# EAGLE design TempSensor (EAGLE 9.6.2)
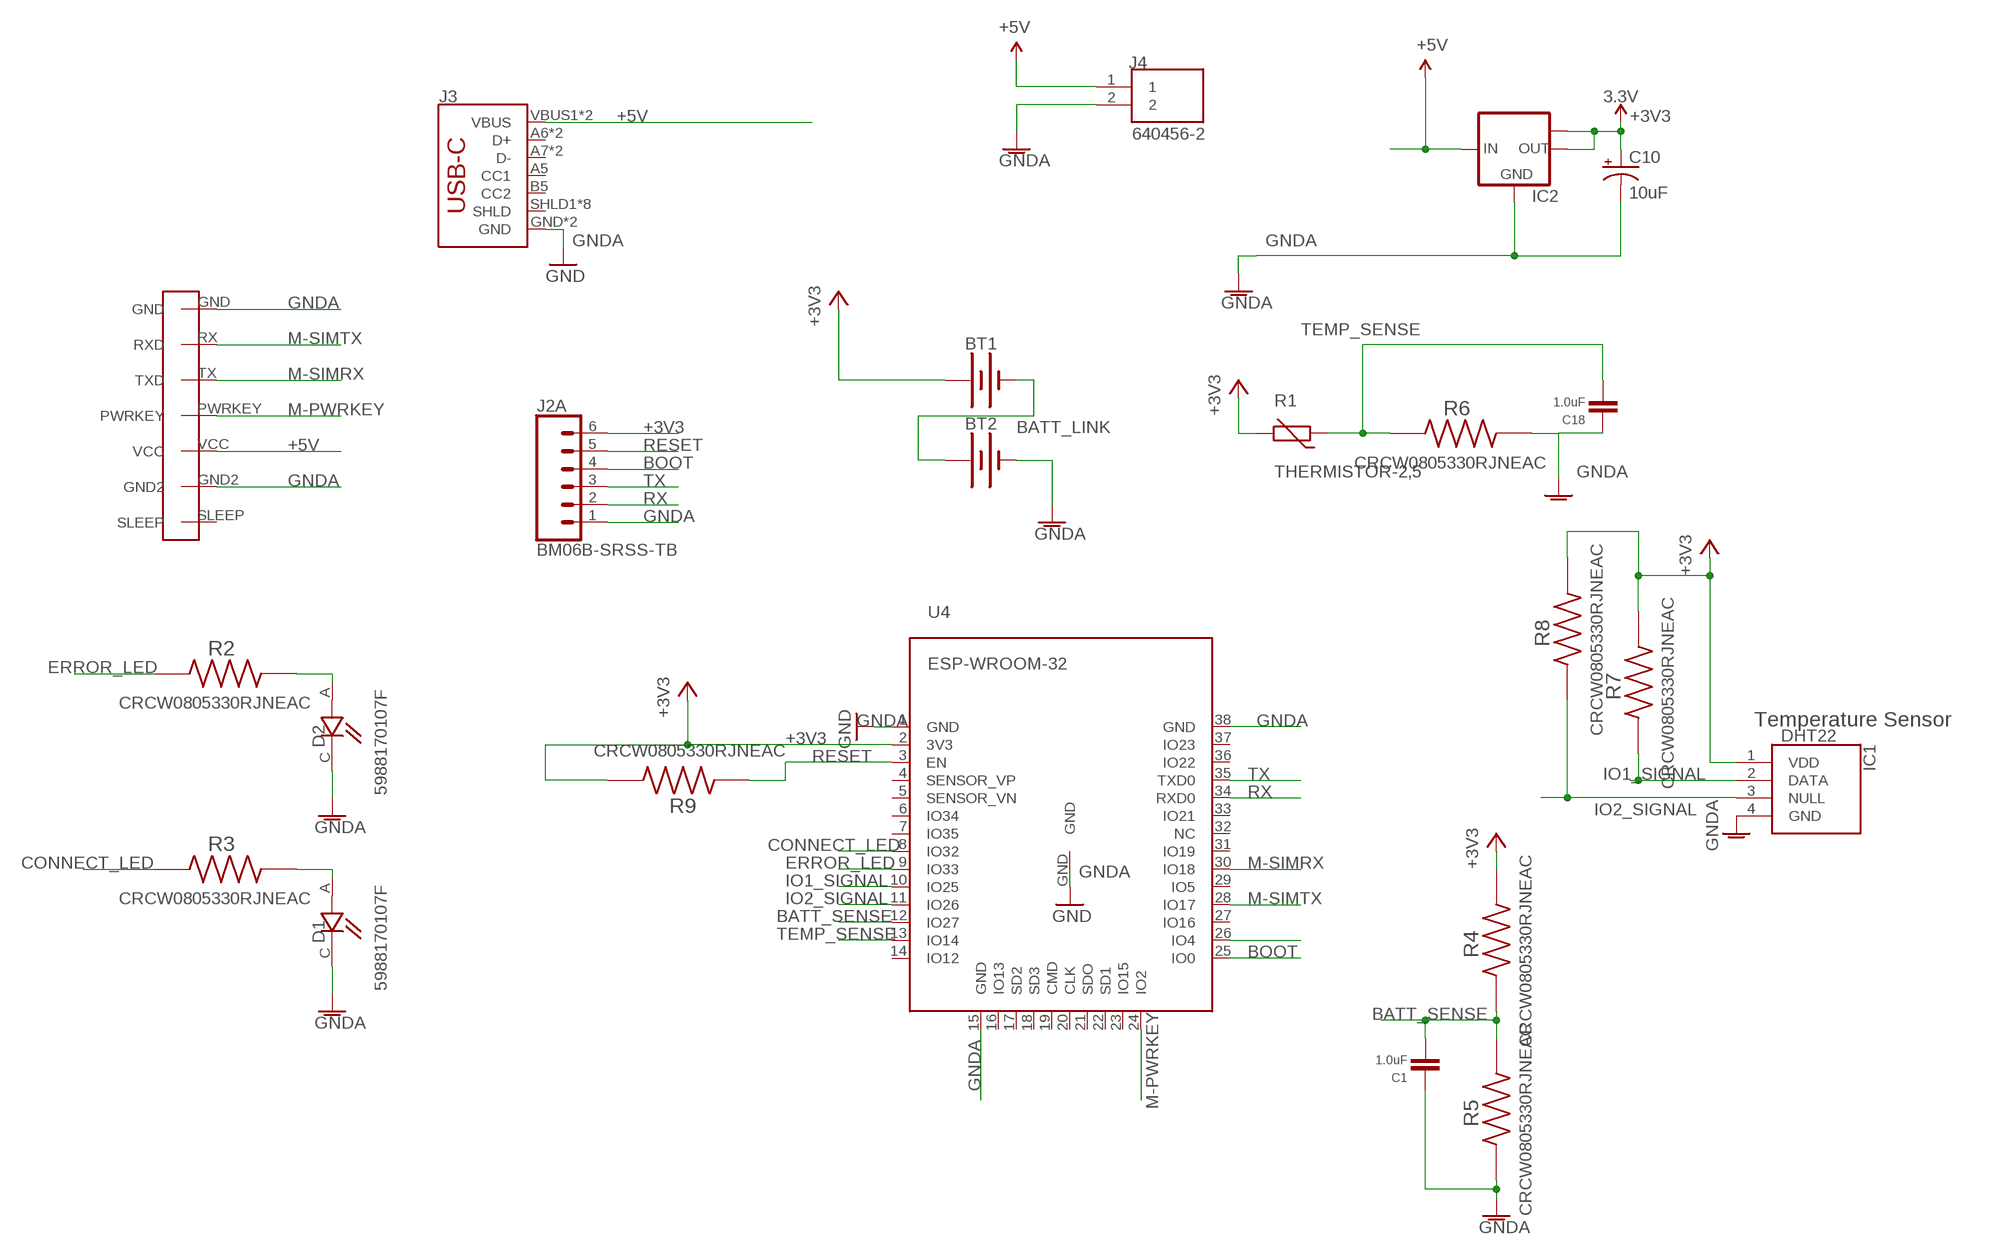
[diagram p0: schematic, sheet 1]

## Parts
BT1  BATTERY-AA  [BATTERY-AA]
BT2  BATTERY-AA  [BATTERY-AA]
C1  1.0uF  1.0UF-0805-25V-(+80/-20%)  [0805]
C10  10uF  10UF-POLAR-EIA3216-16V-10%(TANT)  [EIA3216]
C18  1.0uF  1.0UF-0805-25V-(+80/-20%)  [0805]
D1  5988170107F  [LEDC2012X70N]
D2  5988170107F  [LEDC2012X70N]
IC1  DHT22  [DHT22]
IC2  LM1117MPX-3.3  [SOT223]
J1  SIM7000A  [SIM7000A]
J2  BM06B-SRSS-TB  JST_6_PIN_HORIZONTAL  [JST-6-SMD-HORI-1.0MM]
J3  USB_C16PIN  [USB-C-16P]
J4  640456-2  [TE_640456-2]
R1  THERMISTOR-2,5  [RS-2,5]
R2  CRCW0805330RJNEAC  [RESC2012X60N]
R3  CRCW0805330RJNEAC  [RESC2012X60N]
R4  CRCW0805330RJNEAC  [RESC2012X60N]
R5  CRCW0805330RJNEAC  [RESC2012X60N]
R6  CRCW0805330RJNEAC  [RESC2012X60N]
R7  CRCW0805330RJNEAC  [RESC2012X60N]
R8  CRCW0805330RJNEAC  [RESC2012X60N]
R9  CRCW0805330RJNEAC  [RESC2012X60N]
U4  ESP-WROOM-32  [ESP-WROOM-32]

## Nets
+3V3 [5V Power]: BT1.PWR@1(+) C10.+ IC1.1(VDD) IC2.2(OUT) IC2.TAB(OUT1) J2.6 R1.2 R4.2 R7.2 R8.2 R9.2 U4.2(3V3) ; supply symbol labelled 3.3V
+5V [5V Power]: IC2.3(IN) J1.VCC J3.VBUS1(VBUS) J3.VBUS2(VBUS) J4.1 ; supply symbol labelled 5V
BATT_LINK: BT1.GND@1(-) BT2.PWR@1(+)
BATT_SENSE: C1.2 R4.1 R5.2 U4.12(IO27)
BOOT: J2.4 U4.25(IO0)
CONNECT_LED: R3.1 U4.8(IO32)
ERROR_LED: R2.1 U4.9(IO33)
GNDA: BT2.GND@1(-) C1.1 C10.- C18.1 D1.C D2.C IC1.4(GND) IC2.1(GND) J1.GND J1.GND2 J2.1 J3.GND J3.GND2(GND) J4.2 R5.1 R6.2 U4.1(GND) U4.15(GND) U4.38(GND) U4.GND ; supply symbol labelled GND
IO1_SIGNAL: IC1.2(DATA) R7.1 U4.10(IO25)
IO2_SIGNAL: IC1.3(NULL) R8.1 U4.11(IO26)
M-PWRKEY: J1.PWRKEY U4.24(IO2)
M-SIMRX: J1.TX(TXD) U4.30(IO18)
M-SIMTX: J1.RX(RXD) U4.28(IO17)
N$1: U4.26(IO4)
N$5: D1.A R3.2
N$6: D2.A R2.2
RESET: J2.5 R9.1 U4.3(EN)
RX: J2.2 U4.34(RXD0)
TEMP_SENSE [LOGIC]: C18.2 R1.1 R6.1 U4.13(IO14)
TX: J2.3 U4.35(TXD0)
Unconnected: J1.SLEEP J2.M1 J2.M2 J3.A5(CC1) J3.A6(D+) J3.A7(D-) J3.B5(CC2) J3.B6(D+) J3.B7(D-) J3.SHLD1(SHLD) J3.SHLD2(SHLD) J3.SHLD3(SHLD) J3.SHLD4(SHLD) J3.SHLD5(SHLD) J3.SHLD6(SHLD) J3.SHLD7(SHLD) J3.SHLD8(SHLD) U4.4(SENSOR_VP) U4.5(SENSOR_VN) U4.6(IO34) U4.7(IO35) U4.14(IO12) U4.16(IO13) U4.17(SD2) U4.18(SD3) U4.19(CMD) U4.20(CLK) U4.21(SDO) U4.22(SD1) U4.23(IO15) U4.27(IO16) U4.29(IO5) U4.31(IO19) U4.32(NC) U4.33(IO21) U4.36(IO22) U4.37(IO23)

## Notes on the sheet
- Temperature Sensor

## Library data of the parts
BT1 BT2 = SparkFun-Batteries:BATTERY: Battery - Single Cell A variety of battery chemistries, sizes, and footprints. Device List: 20MM_PTH - Coin Cell Battery Holder - 20mm (PTH) <https://www.sparkfun.com/products/783> 6.8MM_PTH - Coin Cell Battery Holder - 6.8MM(SMD) <https://www.digikey.com/product-detail/en/seiko-instruments/MS621FE-FL11E/728-1057-ND/1889208?WT.srch=1&gclid=CNOQ5a6LzdQCFZS2wAodXCkE0g> 12MM_SMD - Coin Cell Battery Holder - 12mm (SMD) <https://www.sparkfun.com/products/10592> 12MM_PTH - Coin Cell Battery Holder - 12mm (PTH) <https://www.sparkfun.com/products/7948> 20MM_SMD - 20mm Coin Cell Battery Holder (SMD) (2 legs) Used on the Big Time Watch Kit <https://www.sparkfun.com/products/11734> 20MM_SMD_4LEGS - Coin Cell Battery Holder - 20mm (SMD) <https://www.sparkfun.com/products/11892> 20MM_SMD_4LEGS_OVERPASTE - Coin Cell Battery Holder - 20mm (SMD) <https://www.sparkfun.com/products/11892> (Over-paste on the legs) 24.5MM_PTH - Coin Cell Battery Holder - 24.5mm (PTH) <https://www.sparkfun.com/products/8863> 9V - 9V Battery Holder - PC Mount Used on the SparkFun SparkPunk Sound Kit <https://www.sparkfun.com/products/11177> and SparkFun SparkPunk Sequencer Kit <https://www.sparkfun.com/products/12707> 18650 - Battery Holder - 18650 (PTH) <https://www.sparkfun.com/products/13113> AA - Battery Holder - 1xAA (PTH) <https://www.sparkfun.com/products/7949> AAA - Battery Holder - 1xAAA (PTH) <https://www.sparkfun.com/products/12718> AA_KIT - Battery Holder - 1xAA (PTH) <https://www.sparkfun.com/products/7949> Special kit package - pads only have exposed copper on one side of the board. AAA_KIT - Battery Holder - 1xAAA (PTH) <https://www.sparkfun.com/products/12718> Special kit package - pads only have exposed copper on one side of the board.; PROD_ID: BATT-08316; SF_SKU: PRT-07949
C1 C18 = SparkFun-Capacitors:1.0UF: 1µF ceramic capacitors A capacitor is a passive two-terminal electrical component used to store electrical energy temporarily in an electric field.; PROD_ID: CAP-11625
C10 = SparkFun-Capacitors:10UF-POLAR: 10.0µF polarized capacitors A capacitor is a passive two-terminal electrical component used to store electrical energy temporarily in an electric field.; PROD_ID: CAP-00811
D1 D2 = 5988170107F:5988170107F: Standard LEDs - SMD Green Water Clr 40mcd 570nm; DESCRIPTION: Green 566nm LED Indication - Discrete 2V 0805 (2012 Metric); DIGI-KEY_PART_NUMBER: 350-2044-1-ND; MF: Dialight; MP: 5988170107F; PACKAGE: 0805 Dialight; PURCHASE-URL: https://pricing.snapeda.com/search/part/5988170107F/?ref=eda
IC1 = DHT22:DHT22: Digital-output relative humidity & temperature sensor/module DHT22 Source: Datasheet <https://datasheet4u.com/datasheet-parts/DHT22-datasheet.php?id=792211>; DESCRIPTION: Digital-output relative humidity & temperature sensor/module DHT22; HEIGHT: 25.1mm; MANUFACTURER_NAME: Aosong Electronics; MANUFACTURER_PART_NUMBER: DHT22
IC2 = lm1117:LM1117MPX-*
J1 = SoftwareLogisticsParts:SIM7000A
J2 = SparkFun-Connectors:JST_6_PIN_HORIZONTAL: JST 6 pin horizontal connector JST-SH type. Here is the connector we sell at SparkFun: name <link> (XXX-00000) Datasheet <http://www.sparkfun.com/datasheets/GPS/EM406-SMDConnector-eSH.pdf> It was used on these SparkFun products: name <link> (XXX-00000) name <link> (XXX-00000); PROD_ID: XXX-00000
J3 = SparkFun-Connectors:USB_C: USB Type C 16Pin Connector Super Speed pins not available on the 16-pin purely SMD connector so this part is best for USB 2.0 implementations. D1 and D2 are tied together enabling D+/- no matter which way the cable is plugged into the connector. The two channel configuration pins (CC1/2) are exposed. These are normally connected to ground via 5.1k resistors but can be reconfigured for high current/high power applications.; PROD_ID: CONN-14122
J4 = 640456-2:640456-2: 220P MTA100 HDR ASSY SQ SPCL; COMMENT: 640456-2; DESCRIPTION: Connector Header Through Hole 2 position 0.100 (2.54mm); DIGI-KEY_PART_NUMBER: A1921-ND; EU_ROHS_COMPLIANCE: Compliant; MF: TE Connectivity; MP: 640456-2; PACKAGE: None; PURCHASE-URL: https://pricing.snapeda.com/search/part/640456-2/?ref=eda
R1 = varistor:THERMISTOR: THERMISTOR
R2-R9 = CRCW0805330RJNEAC:CRCW0805330RJNEAC; DESCRIPTION: 330 Ohms ±5% 0.125W, 1/8W Chip Resistor 0805 (2012 Metric) - Thick Film; DIGI-KEY_PART_NUMBER: 541-4168-1-ND; MF: Vishay; MP: CRCW0805330RJNEAC; PACKAGE: 2012 Vishay; PURCHASE-URL: https://pricing.snapeda.com/search/part/CRCW0805330RJNEAC/?ref=eda
U4 = esp32:ESP-WROOM-32

## Net classes
1 5V Power: width 0.203 mm
3 LOGIC: width 0.203 mm

## Board
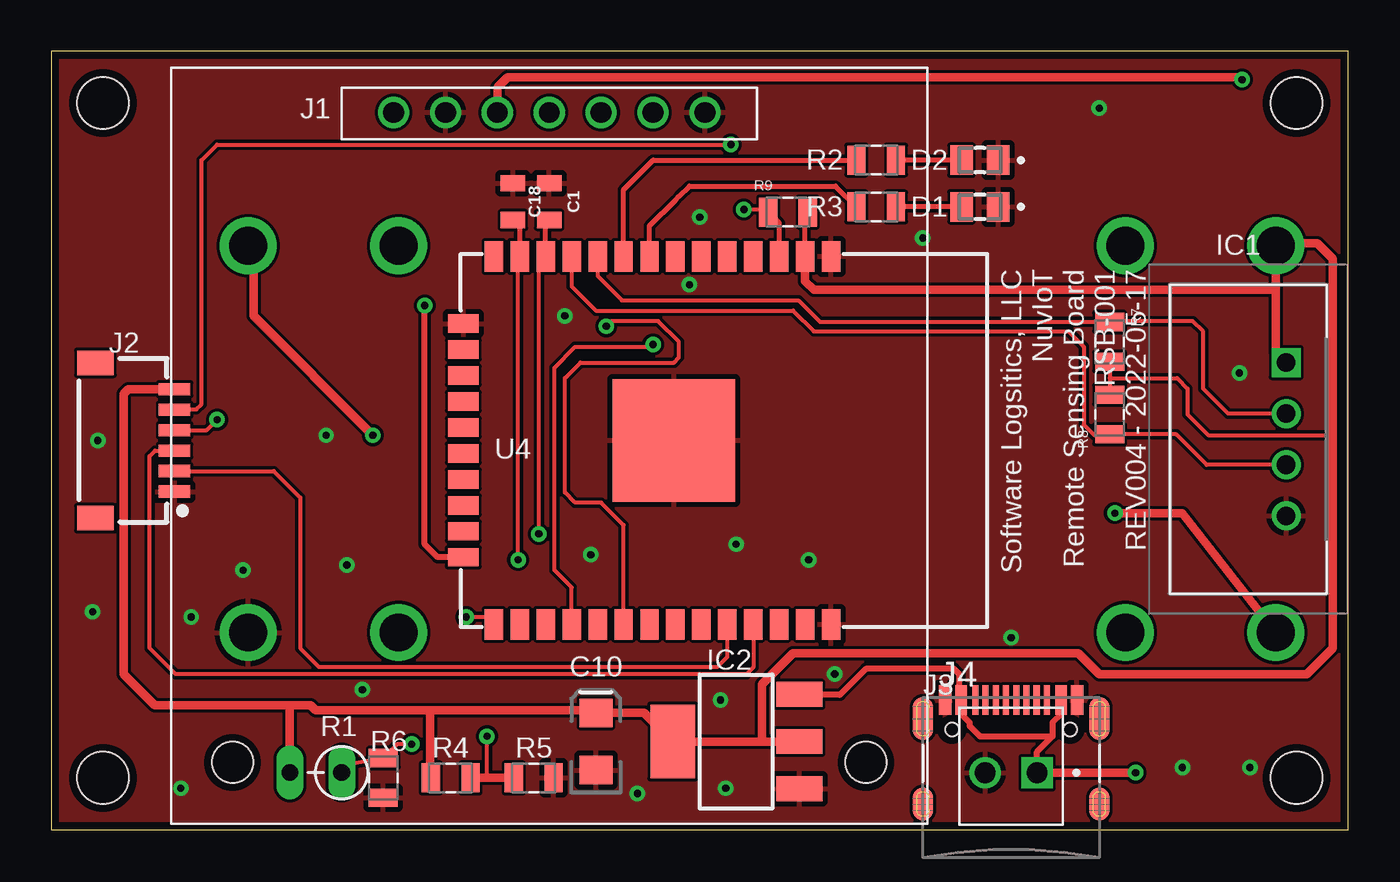
[diagram p1: board, top side]
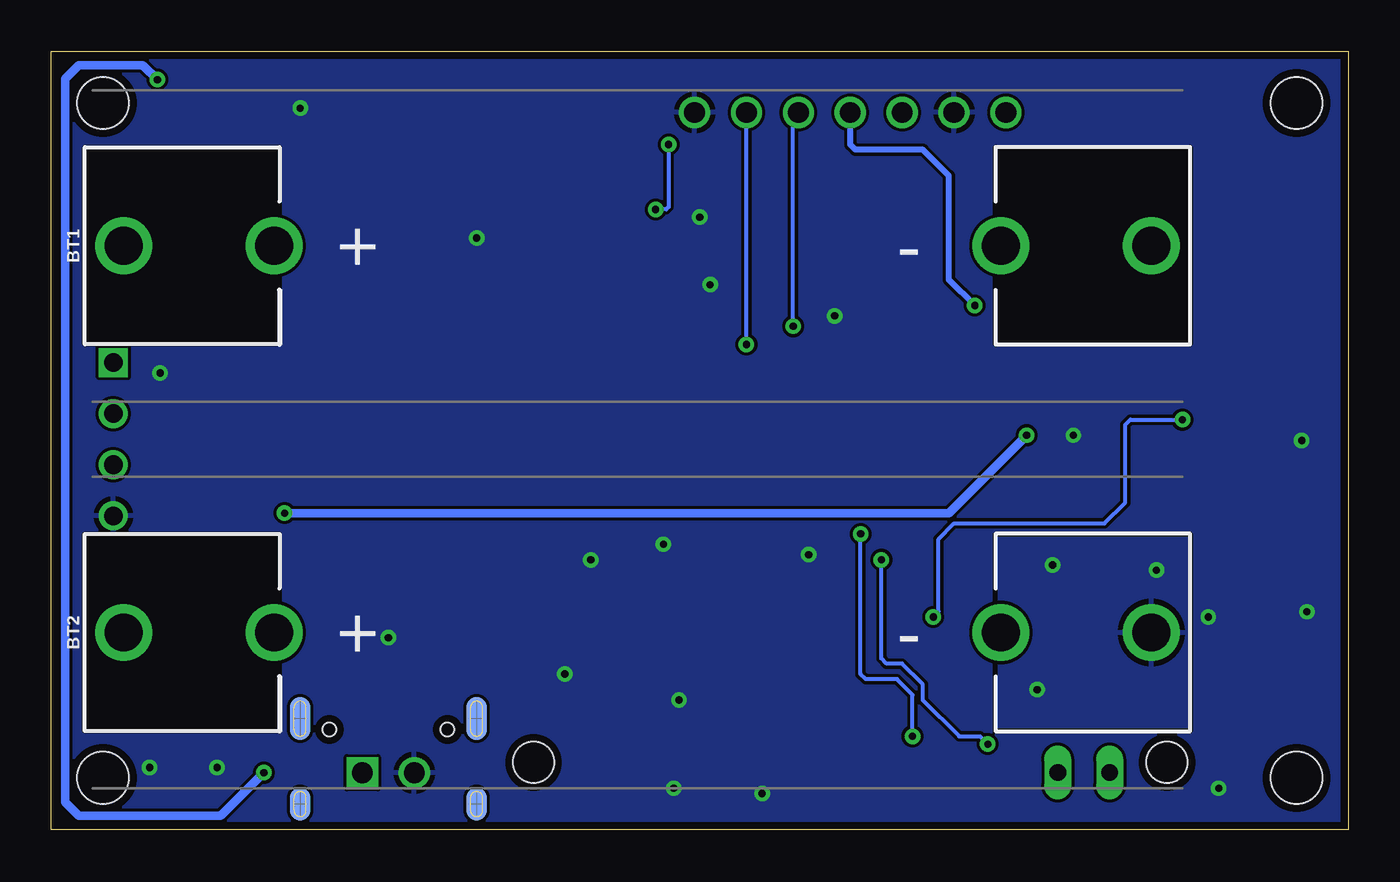
[diagram p2: board, bottom side, seen from below]

Size 63.5 x 38.1 mm. Coordinates in mm from the lower left corner, seen from the top.
Outline: 0,0 63.5,0 63.5,38.1 0,38.1 0,0
Copper layers (1*16): Top 0.035mm / dielectric 1.5mm / Bottom 0.035mm
Design rules "default *": minimum track width 6mil, minimum drill 0.35mm, track to track 6mil, track to pad 6mil, pad to pad 6mil, via to via 6mil, smd to smd 6mil, copper to edge 15mil, drill to drill 6mil, minimum pad ring 10mil, minimum via ring 8mil, stop-mask expansion 4mil, vias tented up to drill 0mil, thermal gap 10mil
Holes 2.54 mm at 2.54,35.56 2.54,2.54 60.96,2.54 60.96,35.56

### Footprints (pad centres in the part's own frame; a part is rotated, then mirrored left to right if it is on the bottom)
BATTERY-AA = drill 1.854: GND@1 25.146,0; GND@2 17.78,0; PWR@1 -25.146,0; PWR@2 -17.78,0
0805 = smd 0.8 x 1.2: 1 -0.9,0; 2 0.9,0
EIA3216 = smd 1.4 x 1.6: + 1.4,0; - -1.4,0
LEDC2012X70N = smd 1.1 x 1.45: A 0.9,0; C -0.9,0
DHT22 = drill 0.91 pad 1.416 square: 1 0,0 | drill 0.91 pad 1.416: 2 2.5,0; 3 5,0; 4 7.5,0
SOT223 = smd 1.219 x 2.235: 1 -2.311,-3.099; 2 0,-3.099; 3 2.311,-3.099 | smd 3.6 x 2.2: TAB 0,3.099
SIM7000A = drill 1.016: GND -16.3,7.62; GND2 -16.3,-5.08; PWRKEY -16.3,0; RX -16.3,5.08; SLEEP -16.3,-7.62; TX -16.3,2.54; VCC -16.3,-2.54 | hole 2: 15.5,-15.5; 15.5,15.5
JST-6-SMD-HORI-1.0MM = smd 0.6 x 1.55: 1 -2.5,-4.775; 2 -1.5,-4.775; 3 -0.5,-4.775; 4 0.5,-4.775; 5 1.5,-4.775; 6 2.5,-4.775 | smd 1.2 x 1.8: M1 -3.8,-0.9; M2 3.8,-0.9
USB-C-16P = smd 0.3 x 1.45: A5 -1.25,0; A6 -0.25,0; A7 0.25,0; A8 1.25,0; B5 1.75,0; B6 0.75,0; B7 -0.75,0; B8 -1.75,0 | smd 0.6 x 1.45: GND -3.225,0; GND2 3.225,0 | smd 1 x 2.1: SHLD1 -4.32,-0.915; SHLD2 4.32,-0.915 | smd 1 x 2.1 bottom: SHLD3 -4.32,-0.915; SHLD4 4.32,-0.915 | smd 1 x 1.6: SHLD5 -4.32,-5.095; SHLD8 4.32,-5.095 | smd 1 x 1.6 bottom: SHLD6 -4.32,-5.095; SHLD7 4.32,-5.095 | smd 0.55 x 1.45: VBUS1 -2.45,0; VBUS2 2.45,0 | hole 0.65: -2.89,-1.445; 2.89,-1.445
TE_640456-2 = drill 1.02 pad 1.37 square: 1 0,0 | drill 1.02 pad 1.37: 2 -2.54,0
RS-2,5 = drill 0.813 long: 1 -1.27,0; 2 1.27,0
RESC2012X60N = smd 0.89 x 1.42: 1 -0.97,0; 2 0.97,0
ESP-WROOM-32 = smd 0.9 x 1.5: 1 7.7,9; 2 6.43,9; 3 5.16,9; 4 3.89,9; 5 2.62,9; 6 1.35,9; 7 0.08,9; 8 -1.19,9; 9 -2.46,9; 10 -3.73,9; 11 -5,9; 12 -6.27,9; 13 -7.54,9; 14 -8.81,9; 25 -8.81,-9; 26 -7.54,-9; 27 -6.27,-9; 28 -5,-9; 29 -3.73,-9; 30 -2.46,-9; 31 -1.19,-9; 32 0.08,-9; 33 1.35,-9; 34 2.62,-9; 35 3.89,-9; 36 5.16,-9; 37 6.43,-9; 38 7.7,-9 | smd 1.5 x 0.9: 15 -10.3,5.715; 16 -10.3,4.445; 17 -10.3,3.175; 18 -10.3,1.905; 19 -10.3,0.635; 20 -10.3,-0.635; 21 -10.3,-1.905; 22 -10.3,-3.175; 23 -10.3,-4.445; 24 -10.3,-5.715 | smd 6 x 6: GND 0,0

### Placement (x,y rotation side)
BT1  34.8,28.57 0 bottom
BT2  34.8,9.65 0 bottom
C1  24.38,30.73 270 top
C10  26.67,4.32 90 top
C18  22.61,30.73 270 top
D1  45.47,30.48 180 top
D2  45.47,32.77 180 top
IC1  60.45,22.86 270 top
IC2  33.53,4.32 90 top
J1  24.38,18.8 270 top
J2  1.27,19.05 90 top
J3  46.99,6.35 0 top
J4  48.26,2.79 0 top
R1  12.95,2.79 180 top
R2  40.39,32.77 0 top
R3  40.39,30.48 0 top
R4  19.56,2.54 180 top
R5  23.62,2.54 180 top
R6  16.26,2.54 270 top
R7  51.82,23.88 270 top
R8  51.82,20.32 90 top
R9  36.07,30.23 0 top
U4  30.48,19.05 0 top

### Tracks (layer width: path | path; a pad name or v marks a point on that pad's centre or on a via)
+3V3
  Top 0.203: R7.2 51.82,22.1 | 51.82,22.1 R8.2 | 51.82,22.1 55.12,22.1 55.63,21.59 55.63,20.32 56.64,19.3 62.74,19.3
  Top 0.254: U4.2 36.91,30.1 R9.2
  Top 0.406: 18.54,5.84 18.54,2.59 R4.2 | 18.54,5.84 26.55,5.84 C10.+ 29.03,5.72 IC2.TAB 34.8,4.32 | J2.6 3.77,21.55 3.56,21.34 3.56,7.62 5.08,6.1 11.68,6.1 | IC2.2 34.8,4.32 | 34.8,4.32 34.8,7.11 36.32,8.64 50.29,8.64 51.31,7.62 61.47,7.62 62.74,8.89 62.74,19.3 62.74,27.94 61.98,28.7 60.2,28.7 BT1.PWR@1 59.94,26.42 | 18.54,5.84 12.95,5.84 12.7,6.1 11.68,6.1 | R1.2 11.68,6.1 | IC1.1 59.94,23.37 59.94,26.42 | U4.2 36.91,26.84 37.34,26.42 59.94,26.42
+5V  (via drill 0.35)
  Top 0.305: J3.VBUS2 49.44,5.68 49.02,5.26 49.02,4.57 | J4.1 48.26,3.81 49.02,4.57 | J3.VBUS1 44.54,5.68 44.96,5.26 44.96,5.08 45.47,4.57 49.02,4.57 | 44.45,6.44 44.45,7.62 44.2,7.87 39.88,7.87 38.61,6.6 36.65,6.6 IC2.3
  Top 0.406: J1.VCC 21.84,36.32 22.35,36.83 58.17,36.83 v58.29,36.7 | J3.VBUS1 44.45,6.44 | v53.09,2.79 J4.1
  Bottom 0.406: v53.09,2.79 55.19,0.69 62.15,0.69 62.81,1.35 62.81,36.75 62.15,37.41 59,37.41 v58.29,36.7
BATT_LINK  (via drill 0.35)
  Top 0.406: BT1.GND@1 9.91,28.32 9.91,25.15 v15.75,19.3 | v52.07,15.49 55.37,15.49 BT2.PWR@1
  Bottom 0.406: v52.07,15.49 19.56,15.49 v15.75,19.3
BATT_SENSE  (via drill 0.35)
  Top 0.203: 21.34,2.54 v21.34,4.57 | v23.88,14.48 23.88,27.86 24.21,28.19
  Top 0.254: U4.12 24.21,28.19 24.21,29.66
  Top 0.406: R4.1 21.34,2.54 R5.2 | 24.21,29.66 C1.2
  Bottom 0.203: v21.34,4.57 21.34,6.6 22.1,7.37 23.62,7.37 23.88,7.62 v23.88,14.48
BOOT  (via drill 0.35)
  Top 0.203: J2.4 7.61,19.55 v8.13,20.07 | U4.25 21.31,10.41 v20.32,10.41
  Bottom 0.203: v8.13,20.07 10.67,20.07 10.92,19.81 10.92,16 11.94,14.99 19.3,14.99 20.07,14.22 20.07,10.67 v20.32,10.41
CONNECT_LED
  Top 0.254: R3.1 38.4,31.5 31.24,31.5 30.73,30.99 30.56,30.81 29.29,29.54 U4.8
ERROR_LED
  Top 0.254: U4.9 28.02,31.32 29.46,32.77 R2.1
GNDA  (via drill 0.35)
  other vias: 33.02,2.03 28.7,1.78 37.08,13.21 33.53,13.97 51.31,35.31 46.99,9.4 58.67,3.05 55.37,3.05 42.67,28.96 2.03,10.67 6.35,2.03 9.4,12.7 6.86,10.41 13.46,19.3 2.29,19.05 14.48,12.95 15.24,6.86 32.77,6.35 26.42,13.46 25.15,25.15 31.75,29.97 58.17,22.35 31.24,26.67 38.35,7.62
  pour Top: 0.25,37.85 63.25,37.85 63.25,0.25 0.51,0.25 0.25,0
  pour Bottom: 0.25,37.85 63.25,37.85 63.25,0.25 0.25,0.25
IO1_SIGNAL
  Top 0.203: IC1.2 57.62,20.36 56.39,21.59 56.39,24.38 55.88,24.89 51.86,24.89 R7.1 37.64,24.85 36.58,25.91 27.94,25.91 26.75,27.1 U4.10
IO2_SIGNAL
  Top 0.203: IC1.3 56.56,17.86 55.07,19.35 R8.1 51.77,19.3 51.05,19.3 50.55,19.81 50.55,23.62 49.78,24.38 37.34,24.38 36.32,25.4 26.67,25.4 25.48,26.59 U4.11
M-PWRKEY  (via drill 0.35)
  Top 0.305: U4.24 18.92,13.34 18.29,13.97 v18.29,25.65
  Bottom 0.305: v18.29,25.65 19.56,26.92 19.56,32 20.83,33.27 24.13,33.27 24.38,33.53 J1.PWRKEY
M-SIMRX  (via drill 0.35)
  Top 0.203: U4.30 28.02,14.91 26.92,16 25.65,16 25.15,16.51 25.15,22.1 25.91,22.86 30.48,22.86 30.73,23.11 30.73,23.88 29.72,24.89 27.43,24.89 v27.18,24.64
  Bottom 0.203: v27.18,24.64 27.18,34.84 J1.TX
M-SIMTX  (via drill 0.35)
  Top 0.203: U4.28 25.48,11.86 24.64,12.7 24.64,22.61 25.65,23.62 29.46,23.62 v29.46,23.75
  Bottom 0.203: v29.46,23.75 J1.RX
N$5
  Top 0.254: D1.A R3.2
N$6
  Top 0.254: D2.A R2.2
RESET  (via drill 0.35)
  Top 0.203: J2.5 6.07,20.57 7.11,20.57 7.37,20.83 7.37,32.77 8.13,33.53 v33.27,33.53 | v33.91,30.35 34.97,30.35 35.2,30.12
  Top 0.254: U4.3 35.64,29.68 35.2,30.12 R9.1
  Bottom 0.203: v33.27,33.53 33.27,30.48 33.4,30.35 v33.91,30.35
RX
  Top 0.203: J2.2 10.9,17.55 12.19,16.26 12.19,8.89 13.11,7.98 32.61,7.98 33.1,8.46 U4.34
TEMP_SENSE  (via drill 0.35)
  Top 0.203: R1.1 14.64,3.21 R6.1 16.94,4.19 v17.65,4.19 | v22.86,13.21 22.86,27.97 U4.13
  Top 0.254: C18.2 22.94,29.5 U4.13
  Bottom 0.203: v17.65,4.19 18.03,4.57 19.05,4.57 20.83,6.35 20.83,7.11 21.84,8.13 22.61,8.13 22.86,8.38 v22.86,13.21
TX
  Top 0.203: U4.35 34.37,7.95 34.04,7.62 6.1,7.62 4.83,8.89 4.83,18.29 5.09,18.55 J2.3

### Text on the board
tNames: J1 | Software Logsitics, LLC / NuvIoT / Remote Sensing Board / RSB-001 / REV004 - 2022-05-17